# Altium schematic sheet Ref_2V048_LM4132AMF.SchDoc
size A4; SheetNumber: 11; SheetTotal: 14
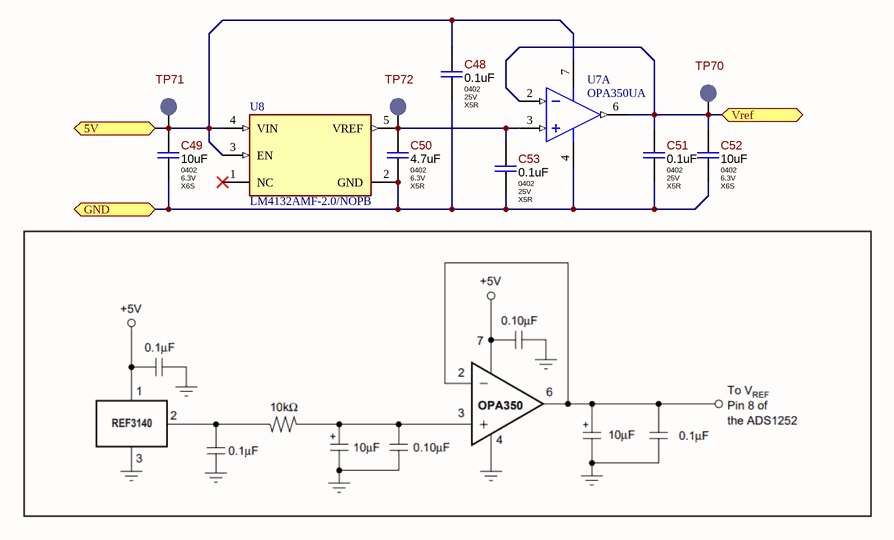
[diagram p0: Ref_2V048_LM4132AMF.SchDoc]

## Parts
C48  Package: 0402  Voltage: 25V  Dielectric Type: X5R  [C_CERAMIC_0402_MED]  (hidden comment: 0.1uF)
C49  Package: 0402  Voltage: 6.3V  Dielectric Type: X6S  [C_CERAMIC_0402_MED]  (hidden comment: 10uF)
C50  Package: 0402  Voltage: 6.3V  Dielectric Type: X5R  [C_CERAMIC_0402_MED]  (hidden comment: 4.7uF)
C51  Package: 0402  Voltage: 25V  Dielectric Type: X5R  [C_CERAMIC_0402_MED]  (hidden comment: 0.1uF)
C52  Package: 0402  Voltage: 6.3V  Dielectric Type: X6S  [C_CERAMIC_0402_MED]  (hidden comment: 10uF)
C53  Package: 0402  Voltage: 25V  Dielectric Type: X5R  [C_CERAMIC_0402_MED]  (hidden comment: 0.1uF)
TP70  LED_LINK  [TP_SMD_2mm]  (value not drawn)  (no BOM)
TP71  LED_LINK  [TP_SMD_2mm]  (value not drawn)  (no BOM)
TP72  LED_LINK  [TP_SMD_2mm]  (value not drawn)  (no BOM)
U7  OPA350UA  [D0008A_M]  (part A of 2)
U8  LM4132AMF-2.0/NOPB  [SOT-23-5]

## Ports
5V (bidir, see Single-ADC_ADS1252U[2C]), GND (bidir, see Single-ADC_ADS1252U[3C]), Vref (bidir, see Single-ADC_ADS1252U[3C])

## Nets
5V: C48.1 C49.1 TP71.1 U7.7(V+) U8.3(EN) U8.4(VIN) ; port 5V
GND: C48.2 C49.2 C50.2 C51.2 C52.2 C53.2 U7.4(V-) U8.2(GND) ; port GND
Vref: C51.1 C52.1 TP70.1 U7.2(IN-) U7.6(OUT) ; port Vref
NetC50_1: C50.1 C53.1 TP72.1 U7.3(IN+) U8.5(VREF)

Not connected (* = marked no-connect by the designer): U8 1(NC)*

## Library data of the parts
C48 C51 C53 = Capacitor-NonPolar: 100nF 25V X5R ±10% 0402 Ceramic Capacitor RoHS; Part Number: CL05A104KA5NNNC; Manufacturer: Samsung Electro-Mechanics; Standard Lead Time: 38 Weeks; Component Status: Released; Replacement: NONE; Value: 0.1uF; Part Type: Ceramic / X5R / 0402; Component Type: SMD; Temperature Range: -55°C ~ 85°C; Tolerance: ±10%; ComponentLink1URL: https://eu.mouser.com/datasheet/2/585/MLCC-1837944.pdf; ComponentLink1Description: Datasheet; Price: 0.0013; Supplier 1: Mouser; Supplier Part Number 1: 187-CL05A104KA5NNNC
C49 C52 = Capacitor-NonPolar: 10uF 6.3V X6S ±20% 0402 Ceramic Capacitor RoHS; Part Number: GRM155C80J106ME11D; Manufacturer: Murata Electronics; Component Status: Released; Standard Lead Time: 15 Weeks; Replacement: NONE; Value: 10uF; Part Type: Ceramic / X6S / 0402; Component Type: SMD; Temperature Range: -55°C ~ 105°C; Tolerance: ±20%; ComponentLink1URL: https://search.murata.co.jp/Ceramy/image/img/A01X/G101/ENG/GRM155C80J106ME11-01.pdf; Supplier 1: Digi-Key; Supplier Part Number 1: 490-13233-1-ND; Price: 0.01104; ComponentLink1Description: Datasheet
C50 = Capacitor-NonPolar: 4.7uF 6.3V X5R ±20% 0402 Ceramic Capacitor RoHS; Part Number: GRM155R60J475ME47; Manufacturer: Murata Electronics; Component Status: Released; Standard Lead Time: 15 Weeks; Replacement: CC0402MRX5R5BB475; Value: 4.7uF; Part Type: Ceramic / X5R / 0402; Component Type: SMD; Temperature Range: -55°C ~ 85°C; Tolerance: ±20%; ComponentLink1URL: https://search.murata.co.jp/Ceramy/image/img/A01X/G101/ENG/GRM155R60J475ME47-01.pdf; Supplier 1: Digi-Key; Supplier Part Number 1: 490-5915-2-ND; Price: 0.013; ComponentLink1Description: Datasheet
TP70-TP72 = Test-Point-SMD-1: Test Point SMD Pad 1.0mm/1.5mm/2mm; Part Number: TP-PAD-SMD; Replacement: NONE; Part Type: Test Point; Component Type: SMD; Temperature Range: NONE; ComponentLink1URL: NONE; ComponentLink1Description: Datasheet
U7 = TI-OPA-8_1: High-Speed, Single-Supply, Rail-to-Rail Operational Amplifier MicroAmplifier(TM) Series, 2.7 to 5.5 V, -40 to 85 degC, 8-pin SOIC (D8), Green (RoHS & no Sb/Br); Manufacturer: Texas Instruments; IIB(Max)(pA): 10; Iq per channel(Max)(mA): 8.5; Number of Channels: 1; CMRR(Min)(dB): 66; Slew Rate(Typ)(V/us): 22; Total Supply Voltage(Max)(+5V is 5, +/-5V is 10): 5.5; Sub Family: Low Input Bias Current Amp (<=10pA), Low Offset Voltage Amplifier (<=500uV), Low Supply Voltage Amplifier (<=2.7V), Precision Amplifier; Offset Drift(Typ)(uV/C): 4; Total Supply Voltage(Min)(+5V is 5, +/-5V is 10): 2.7; Vn at 1kHz(Typ)(nV/rtHz): 18; PackageReference: D0008A; PackageDescription: 8-Pin Plastic Small Outline, Body 4.9 x 3.9 mm, Pitch 1.27 mm; Code_JEDEC: MS-012; Eco-Plan: Green (RoHS & no Sb/Br); DatasheetVersion: SBOS099C; Vio (25C)(Max)(mV): 1; ComponentLink1URL: http://www.ti.com/; ComponentLink3URL: http://www.ti.com/litv/pdf/msoi002j; PackageVersion: 4040047-3/M, 06/2011; ComponentLink3Description: Package Specification; ComponentLink2URL: http://www.ti.com/general/docs/lit/getliterature.tsp?genericPartNumber=OPA350&fileType=pdf; PartNumber: OPA350UA; ComponentLink2Description: Datasheet; ComponentLink1Description: Manufacturer URL; Mounting Technology: Surface Mount
U8 = LM4132AMF-2.0/NOPB: IC VREF SERIES 0.05% SOT23-5; Quiescent Current: 100uA; Output Current: 20mA; Number of Channels: 1; Temperature Coefficient: 20ppm/°C; Max Input Voltage: 6V; Output Voltage: 2.5V; Max Supply Voltage: 2.2V; Dropout Voltage: 175mV; Supply Current: 60uA; Output Type: Fixed; Length: 2.92mm; Radiation Hardening: No; Reference Type: Series; Mount: Surface Mount; Packaging: Tape and Reel; Width: 1.6mm; Max Operating Temperature: 125°C; Lead Free: Lead Free; Series: -; Number of Pins: 5; REACH SVHC: No SVHC; Max Output Voltage: 2.5V; Package Quantity: 1000; Tolerance: 0.05%; Min Input Voltage: 2.2V; Case/Package: SOT-23; Termination: SMD/SMT; Height: 1.02mm; Min Output Voltage: 2.5V; Reference Voltage: 2.5V; Max Output Current: 20mA; Nominal Supply Current: 60uA; Min Operating Temperature: -40°C; Operating Supply Current: 100uA; Part Number: LM4132AMF-2.0/NOPB; Supplier 1: Mouser; Supplier Part Number 1: 926-LM4132AMF20NOPB; ComponentLink1Description: Datasheet; ComponentLink1URL: https://www.ti.com/lit/gpn/lm4132-q1